# Altium schematic sheet 0-模块总图.SchDoc
size A4; SheetNumber: 1; SheetTotal: 4
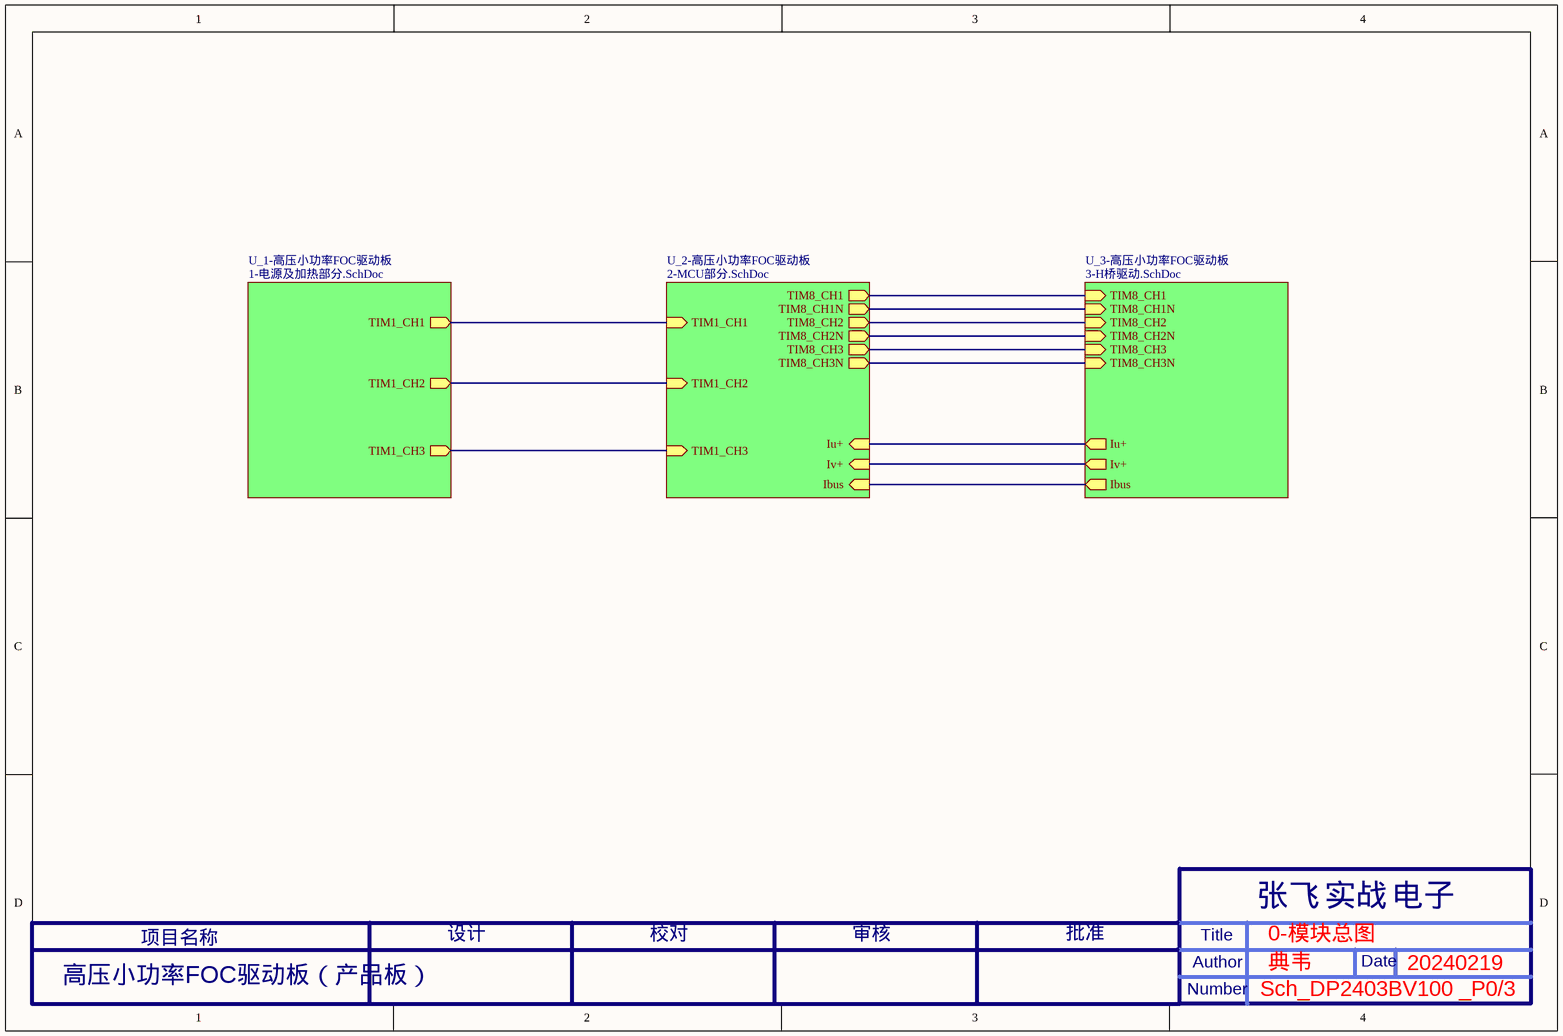
[diagram p0: 0-模块总图.SchDoc]

## Sub-sheets
U_1-高压小功率FOC驱动板 = 1-电源及加热部分.SchDoc: TIM1_CH2 (out), TIM1_CH3 (out), TIM1_CH1 (out)
U_2-高压小功率FOC驱动板 = 2-MCU部分.SchDoc: TIM1_CH2 (in), TIM1_CH3 (in), TIM1_CH1 (in), TIM8_CH1 (out), TIM8_CH1N (out), TIM8_CH2 (out), TIM8_CH2N (out), TIM8_CH3 (out), TIM8_CH3N (out), Ibus (in), Iu+ (in), Iv+ (in)
U_3-高压小功率FOC驱动板 = 3-H桥驱动.SchDoc: TIM8_CH1 (in), TIM8_CH1N (in), TIM8_CH2 (in), TIM8_CH2N (in), TIM8_CH3 (in), TIM8_CH3N (in), Iu+ (out), Iv+ (out), Ibus (out)

## Nets
(unnamed): sheet U_1-高压小功率FOC驱动板/TIM1_CH2, sheet U_2-高压小功率FOC驱动板/TIM1_CH2
(unnamed): sheet U_1-高压小功率FOC驱动板/TIM1_CH3, sheet U_2-高压小功率FOC驱动板/TIM1_CH3
(unnamed): sheet U_1-高压小功率FOC驱动板/TIM1_CH1, sheet U_2-高压小功率FOC驱动板/TIM1_CH1
(unnamed): sheet U_2-高压小功率FOC驱动板/TIM8_CH1, sheet U_3-高压小功率FOC驱动板/TIM8_CH1
(unnamed): sheet U_2-高压小功率FOC驱动板/TIM8_CH1N, sheet U_3-高压小功率FOC驱动板/TIM8_CH1N
(unnamed): sheet U_2-高压小功率FOC驱动板/TIM8_CH2, sheet U_3-高压小功率FOC驱动板/TIM8_CH2
(unnamed): sheet U_2-高压小功率FOC驱动板/TIM8_CH2N, sheet U_3-高压小功率FOC驱动板/TIM8_CH2N
(unnamed): sheet U_2-高压小功率FOC驱动板/TIM8_CH3, sheet U_3-高压小功率FOC驱动板/TIM8_CH3
(unnamed): sheet U_2-高压小功率FOC驱动板/TIM8_CH3N, sheet U_3-高压小功率FOC驱动板/TIM8_CH3N
(unnamed): sheet U_2-高压小功率FOC驱动板/Ibus, sheet U_3-高压小功率FOC驱动板/Ibus
(unnamed): sheet U_2-高压小功率FOC驱动板/Iu+, sheet U_3-高压小功率FOC驱动板/Iu+
(unnamed): sheet U_2-高压小功率FOC驱动板/Iv+, sheet U_3-高压小功率FOC驱动板/Iv+

## Notes on the sheet
- 高压小功率FOC驱动板（产品板）
- 典韦
- 0-模块总图
- 20240219
- Sch_DP2403BV100 _P0/3
- 张飞
- 实战
- 电子
- 项目名称
- 设计
- 校对
- 审核
- 批准
- Author
- Title
- Date
- Number